# EAGLE schematic canSlaveV04 Hoch (EAGLE 6.5.0)
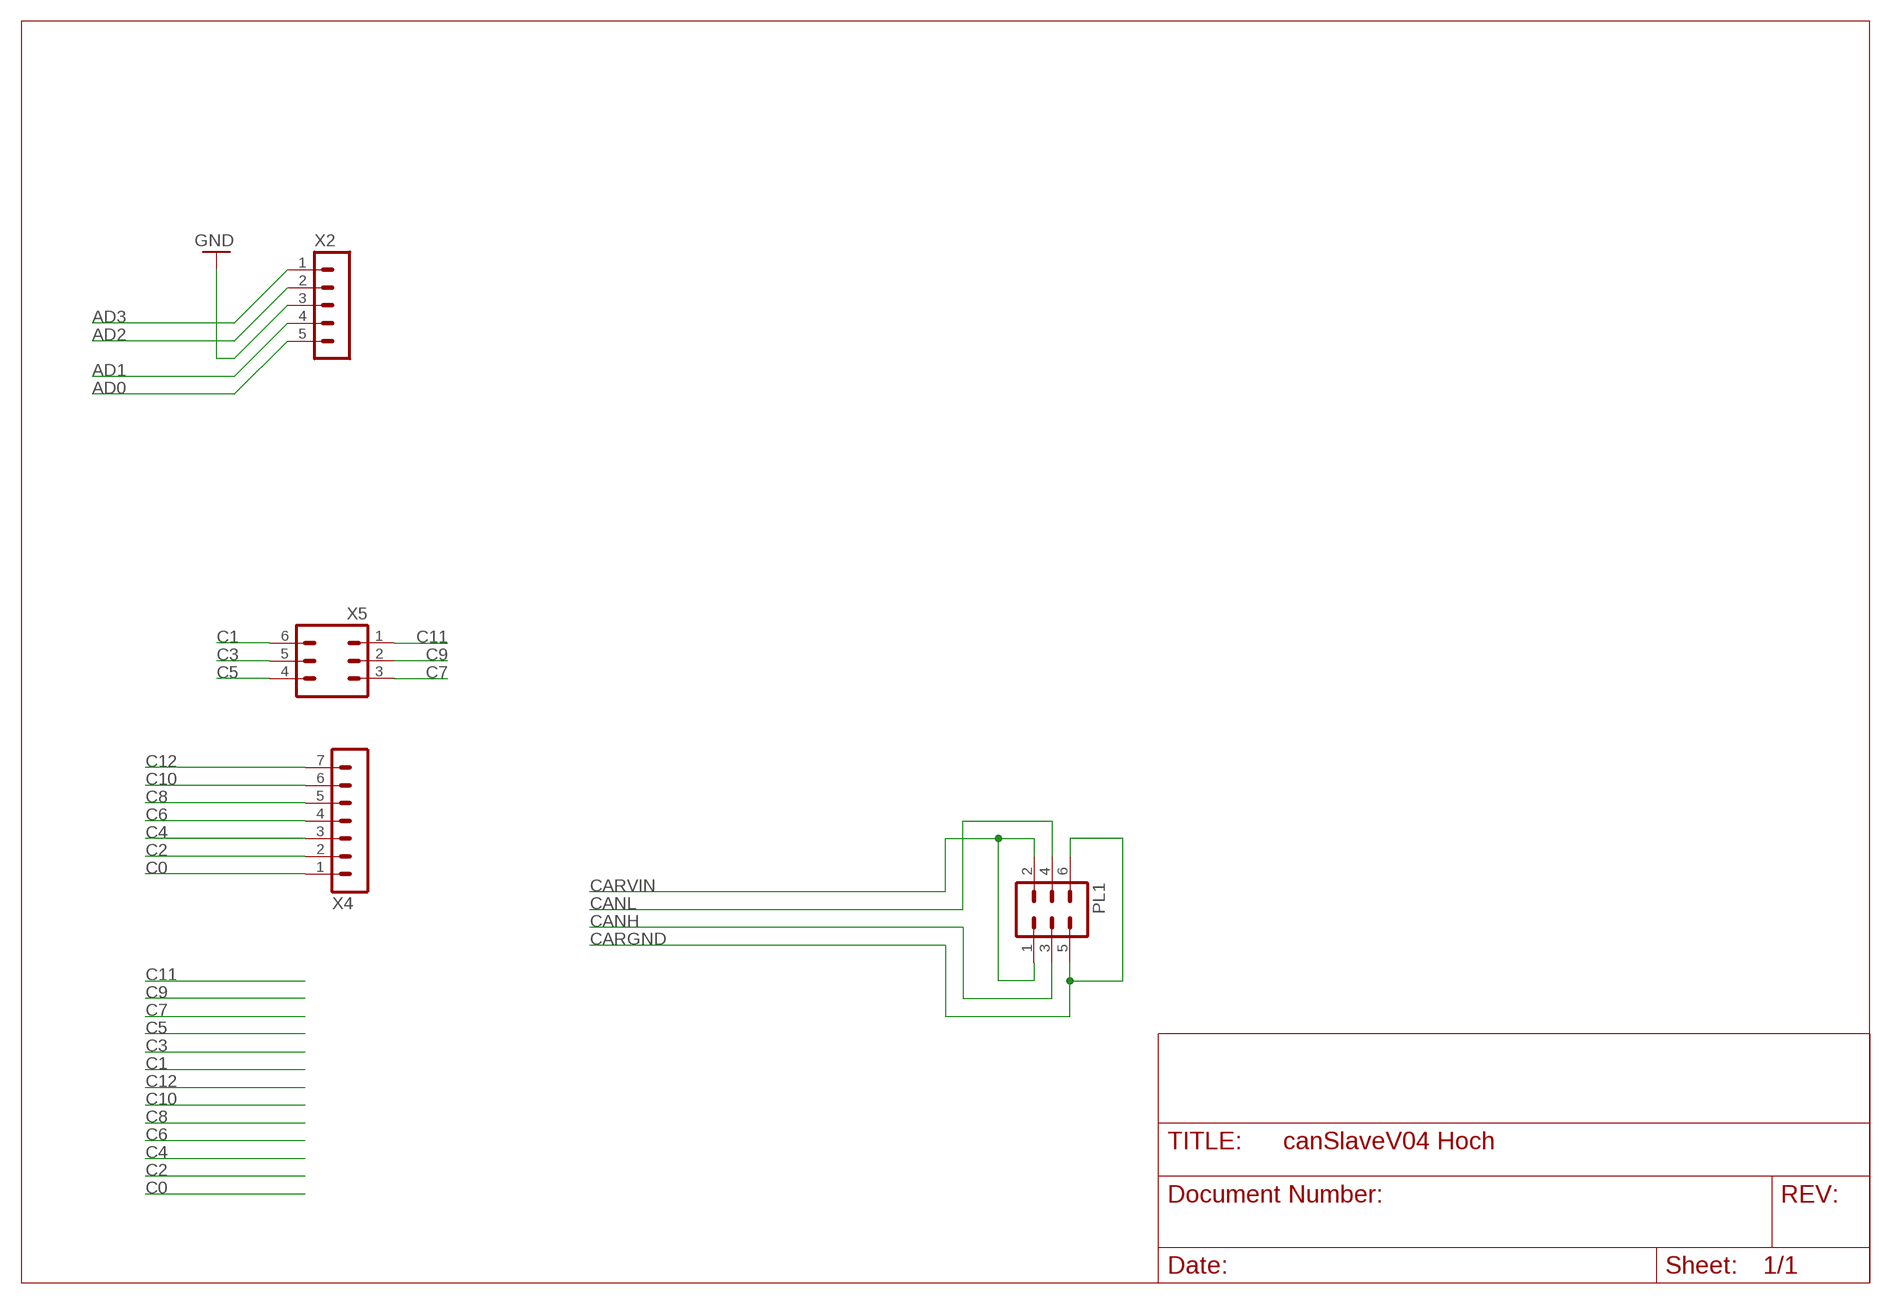
[diagram p0: schematic, sheet 1]

## Parts
PL1  06V  [06V]
X2  HEADER_POS5_43650-0515  [43650-0515]
X4  HEADER_POS7_43650-0715  [43650-0715]
X5  HEADER_POS6_43650-0615  [43650-0615]

## Nets
AD0: X2.5
AD1: X2.4
AD2: X2.2
AD3: X2.1
C0: X4.1
C1: X5.6
C2: X4.2
C3: X5.5
C4: X4.3
C5: X5.4
C6: X4.4
C7: X5.3
C8: X4.5
C9: X5.2
C10: X4.6
C11: X5.1
C12: X4.7
CANH: PL1.3
CANL: PL1.4
CARGND: PL1.5 PL1.6
CARVIN: PL1.1 PL1.2
GND: X2.3

## Library data of the parts
PL1 = con-harting-v:06V: CONNECTOR; OC_FARNELL: unknown; OC_NEWARK: unknown
X2 = con-molex-micro-fit-3_0:HEADER_POS5_?: Molex - Micro-Fit 3.0 Series connector, 3.00mm (0.118") pitch header, 5 positions.
X4 = con-molex-micro-fit-3_0:HEADER_POS7_?: Molex - Micro-Fit 3.0 Series connector, 3.00mm (0.118") pitch header, 7 positions.
X5 = con-molex-micro-fit-3_0:HEADER_POS6_?: Molex - Micro-Fit 3.0 Series connector, 3.00mm (0.118") pitch header, 6 positions.